# EAGLE design motoruino_2010 v1.1 (EAGLE 5.06)
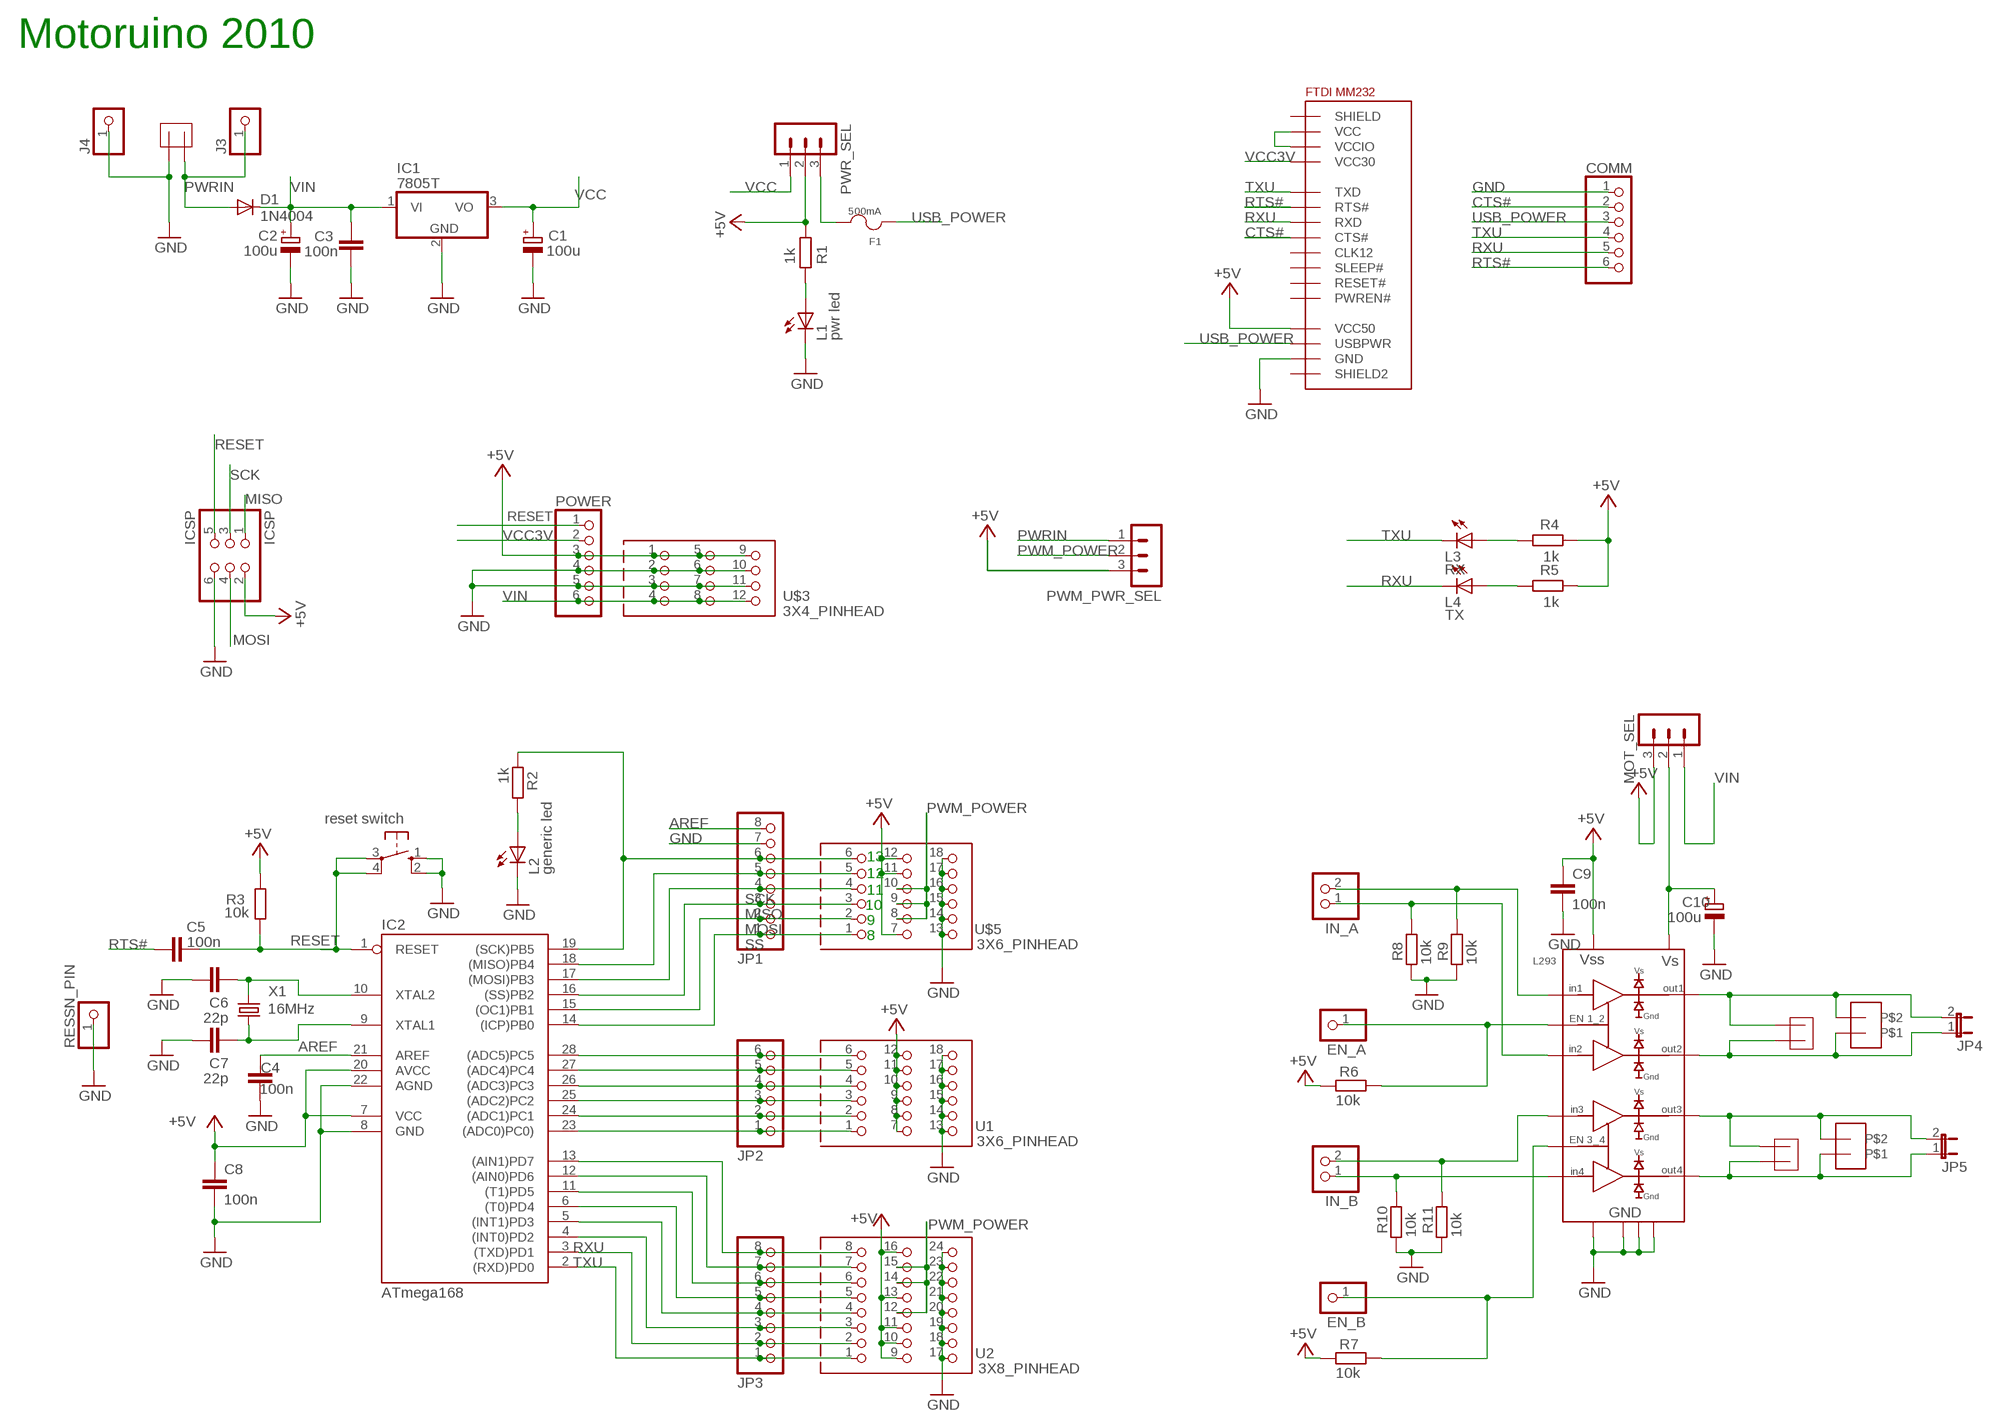
[diagram p0: schematic, sheet 1]

## Parts
C1  100u  CPOL-EUE2.5-7  [E2,5-7]
C2  100u  CPOL-EUE2.5-7  [E2,5-7]
C3  100n  C-EU025-025X050  [C025-025X050]
C4  100n  C-EU025-025X050  [C025-025X050]
C5  100n  C-EU025-025X050  [C025-025X050]
C6  22p  C-EU025-025X050  [C025-025X050]
C7  22p  C-EU025-025X050  [C025-025X050]
C8  100n  C-EU025-025X050  [C025-025X050]
C9  100n  C-EU025-025X050  [C025-025X050]
C10  100u  CPOL-EUE2.5-7  [E2,5-7]
COMM  PINHD-1X6  [1X06]
D1  1N4004  [DO41-10]
EN_A  PINHD-1X1  [1X01]
EN_B  PINHD-1X1  [1X01]
F1  500mA  FUSE  [FUSE_5MM]
IC1  7805T  [TO220H]
IC2  ATmega168  AT90S4433P  [DIL28-3]
IC3  FTDI_MM232R  [MM232_PCKG]
IC4  L293D  [DIP16]
ICSP  ICSP  PINHD-2X3  [2X03]
IN_A  PINHD-1X2  [1X02]
IN_B  PINHD-1X2  [1X02]
J3  PINHD-1X1  [1X01]
J4  PINHD-1X1  [1X01]
JP1  PINHD-1X8  [1X08]
JP2  PINHD-1X6  [1X06]
JP3  PINHD-1X8  [1X08]
JP4  JP1E  [JP1]
JP5  JP1E  [JP1]
L1  pwr led  LED3MM  [LED3MM]
L2  generic led  LED3MM  [LED3MM]
L3  RX  LED3MM  [LED3MM]
L4  TX  LED3MM  [LED3MM]
MOT_SEL  MA03-1  [MA03-1]
POWER  PINHD-1X6  [1X06]
PWM_PWR_SEL  MA03-1  [MA03-1]
PWR_SEL  MA03-1  [MA03-1]
R1  1k  R-EU_0207/10  [0207/10]
R2  1k  R-EU_0207/10  [0207/10]
R3  10k  R-EU_0207/10  [0207/10]
R4  1k  R-EU_0207/10  [0207/10]
R5  1k  R-EU_0207/10  [0207/10]
R6  10k  R-EU_0207/10  [0207/10]
R7  10k  R-EU_0207/10  [0207/10]
R8  10k  R-EU_0207/10  [0207/10]
R9  10k  R-EU_0207/10  [0207/10]
R10  10k  R-EU_0207/10  [0207/10]
R11  10k  R-EU_0207/10  [0207/10]
RESET_SW  reset switch  10-XX  [B3F-10XX]
RESSN_PIN  PINHD-1X1  [1X01]
U1  3X6_PINHEAD  [3X6_PINHEAD]
U2  3X8_PINHEAD  [3X8_PINHEAD]
U$1  2PIN_GEN  [5MM_SCREW_TERM]
U$3  3X4_PINHEAD  [3X4_PINHEAD]
U$5  3X6_PINHEAD  [3X6_PINHEAD]
U$6  2PIN_JST  [2PIN_2MMPITCH]
U$7  2PIN_GEN  [5MM_SCREW_TERM]
U$9  2PIN_JST  [2PIN_2MMPITCH]
U$10  2PIN_GEN  [5MM_SCREW_TERM]
X1  16MHz  CRYTALHC49S  [HC49/S]

## Nets
+5V [usbvcc]: C8.1 C9.1 IC2.7(VCC) IC2.20(AVCC) IC3.P$14(VCC50) IC4.P$16 ICSP.2 MOT_SEL.3 POWER.3 PWM_PWR_SEL.3 PWR_SEL.2 R1.1 R3.2 R4.2 R5.2 R6.2 R7.2 U1.7 U1.8 U1.9 U1.10 U1.11 U1.12 U2.9 U2.10 U2.11 U2.13 U2.16 U$3.1 U$3.5 U$3.9 U$5.7 U$5.11 U$5.12
AREF [aref]: C4.2 IC2.21(AREF) JP1.8
CTS#: COMM.2 IC3.P$8(CTS#)
GND [gnd]: C1.- C2.- C3.1 C4.1 C6.1 C7.1 C8.2 C9.2 C10.- COMM.1 IC1.2(GND) IC2.8(GND) IC2.22(AGND) IC3.P$13(GND) IC4.P$4 IC4.P$5 IC4.P$12 IC4.P$13 ICSP.6 J4.1 JP1.7 L1.K(C) L2.K(C) POWER.4 POWER.5 R8.2 R9.2 R10.2 R11.2 RESET_SW.1(S) RESET_SW.2(S1) RESSN_PIN.1 U1.13 U1.14 U1.15 U1.16 U1.17 U1.18 U2.17 U2.18 U2.19 U2.20 U2.21 U2.22 U2.23 U2.24 U$1.P$1 U$3.2 U$3.3 U$3.6 U$3.7 U$3.10 U$3.11 U$5.13 U$5.14 U$5.15 U$5.16 U$5.17 U$5.18
MISO: IC2.18((MISO)PB4) ICSP.1 JP1.5 U$5.5
MOSI: IC2.17((MOSI)PB3) ICSP.4 JP1.4 U$5.4
N$1: IC4.P$2 IN_A.2 R9.1
N$2: L2.A R2.1
N$3: L1.A R1.2
N$4: IC4.P$7 IN_A.1 R8.1
N$5: IC2.14((ICP)PB0) JP1.1 U$5.1
N$6: C7.2 IC2.9(XTAL1) X1.1
N$7: C6.2 IC2.10(XTAL2) X1.2
N$8: L3.A R4.1
N$9: IC4.P$15 IN_B.1 R10.1
N$10: IC2.4((INT0)PD2) JP3.3 U2.3
N$11: IC2.5((INT1)PD3) JP3.4 U2.4
N$12: IC2.6((T0)PD4) JP3.5 U2.5
N$13: IC2.11((T1)PD5) JP3.6 U2.6
N$14: IC2.12((AIN0)PD6) JP3.7 U2.7
N$15: IC2.13((AIN1)PD7) JP3.8 U2.8
N$16: IC2.23((ADC0)PC0)) JP2.1 U1.1
N$17: IC2.24((ADC1)PC1) JP2.2 U1.2
N$18: IC2.25((ADC2)PC2) JP2.3 U1.3
N$19: IC2.26((ADC3)PC3) JP2.4 U1.4
N$20: IC2.27((ADC4)PC4) JP2.5 U1.5
N$21: IC2.28((ADC5)PC5) JP2.6 U1.6
N$22: IC2.15((OC1)PB1) JP1.2 U$5.2
N$23: IC4.P$10 IN_B.2 R11.1
N$27: L4.A R5.1
N$29: IC3.P$2(VCC) IC3.P$3(VCCIO)
N$30: C10.+ IC4.P$8 MOT_SEL.2
N$31: IC4.P$6 JP4.1 U$6.P$1 U$7.P$1
N$32: EN_A.1 IC4.P$1 R6.1
N$33: IC4.P$3 JP4.2 U$6.P$2 U$7.P$2
N$34: EN_B.1 IC4.P$9 R7.1
N$35: F1.P$2 PWR_SEL.3
N$37: IC4.P$14 JP5.1 U$9.P$1 U$10.P$1
N$38: IC4.P$11 JP5.2 U$9.P$2 U$10.P$2
PWM_POWER [power]: PWM_PWR_SEL.2 U2.12 U2.14 U2.15 U$5.8 U$5.9 U$5.10
PWRIN [power]: D1.A J3.1 PWM_PWR_SEL.1 U$1.P$2
RESET: C5.2 IC2.1(RESET) ICSP.5 POWER.1 R3.1 RESET_SW.3(P) RESET_SW.4(P1)
RTS#: C5.1 COMM.6 IC3.P$6(RTS#)
RXU: COMM.5 IC2.3((TXD)PD1) IC3.P$7(RXD) JP3.2 L4.K(C) U2.2
SCK: IC2.19((SCK)PB5) ICSP.3 JP1.6 R2.2 U$5.6
SS: IC2.16((SS)PB2) JP1.3 U$5.3
TXU: COMM.4 IC2.2((RXD)PD0) IC3.P$5(TXD) JP3.1 L3.K(C) U2.1
USB_POWER: COMM.3 F1.P$1 IC3.P$15(USBPWR)
VCC [usbvcc]: C1.+ IC1.3(VO) PWR_SEL.1
VCC3V: IC3.P$4(VCC30) POWER.2
VIN [power]: C2.+ C3.2 D1.C IC1.1(VI) MOT_SEL.1 POWER.6 U$3.4 U$3.8 U$3.12
Unconnected: IC3.P$1(SHIELD) IC3.P$9(CLK12) IC3.P$10(SLEEP#) IC3.P$11(RESET#) IC3.P$12(PWREN#) IC3.P$16(SHIELD2)

## Notes on the sheet
- Motoruino 2010
- 13
- 12
- 11
- 10
- 9
- 8

## Library data of the parts
C1 C2 C10 = rcl:CPOL-EU: POLARIZED CAPACITOR, European symbol
C3-C9 = rcl:C-EU: CAPACITOR, European symbol
COMM JP2 POWER = pinhead:PINHD-1X6: PIN HEADER
D1 = diode:1N4004: DIODE general purpose rectifier, 1 A
EN_A EN_B J3 J4 RESSN_PIN = pinhead:PINHD-1X1: PIN HEADER
F1 = MeLib _Eagle:FUSE
IC1 = linear:78*: Positive VOLTAGE REGULATOR Source: http://cache.national.com/ds/LM/LM78L05.pdf http://www.fairchildsemi.com/ds/LM/LM7805.pdf
IC2 = atmel:AT90S4433: MICROCONTROLLER 4 Kbytes FLASH 128 bytes SRAM 256 bytes EEPROM UART 6-channel 10 bit ADC
IC3 = MeLib _Eagle:FTDI_MM232R
IC4 = MeLib _Eagle:L293D
ICSP = pinhead:PINHD-2X3: PIN HEADER
IN_A IN_B = pinhead:PINHD-1X2: PIN HEADER
JP1 JP3 = pinhead:PINHD-1X8: PIN HEADER
JP4 JP5 = jumper:JP1E: JUMPER
L1-L4 = led:LED: LED OSRAM: - CHIPLED LG R971, LG N971, LY N971, LG Q971, LY Q971, LO R971, LY R971 LH N974, LH R974 LS Q976, LO Q976, LY Q976 LO Q996 - Hyper CHIPLED LW Q18S LB Q993, LB Q99A, LB R99A - SideLED LS A670, LO A670, LY A670, LG A670, LP A670 LB A673, LV A673, LT A673, LW A673 LH A674 LY A675 LS A676, LA A676, LO A676, LY A676, LW A676 LS A679, LY A679, LG A679 - Hyper Micro SIDELED® LS Y876, LA Y876, LO Y876, LY Y876 LT Y87S - SmartLED LW L88C, LW L88S LB L89C, LB L89S, LG L890 LS L89K, LO L89K, LY L89K LS L896, LA L896, LO L896, LY L896 - TOPLED LS T670, LO T670, LY T670, LG T670, LP T670 LSG T670, LSP T670, LSY T670, LOP T670, LYG T670 LG T671, LOG T671, LSG T671 LB T673, LV T673, LT T673, LW T673 LH T674 LS T676, LA T676, LO T676, LY T676, LB T676, LH T676, LSB T676, LW T676 LB T67C, LV T67C, LT T67C, LS T67K, LO T67K, LY T67K, LW E67C LS E67B, LA E67B, LO E67B, LY E67B, LB E67C, LV E67C, LT E67C LW T67C LS T679, LY T679, LG T679 LS T770, LO T770, LY T770, LG T770, LP T770 LB T773, LV T773, LT T773, LW T773 LH T774 LS E675, LA E675, LY E675, LS T675 LS T776, LA T776, LO T776, LY T776, LB T776 LHGB T686 LT T68C, LB T68C - Hyper Mini TOPLED® LB M676 - Mini TOPLED Santana® LG M470 LS M47K, LO M47K, LY M47K Source: http://www.osram.convergy.de LUXEON: - LUMILED® LXK2-PW12-R00, LXK2-PW12-S00, LXK2-PW14-U00, LXK2-PW14-V00 LXK2-PM12-R00, LXK2-PM12-S00, LXK2-PM14-U00 LXK2-PE12-Q00, LXK2-PE12-R00, LXK2-PE12-S00, LXK2-PE14-T00, LXK2-PE14-U00 LXK2-PB12-K00, LXK2-PB12-L00, LXK2-PB12-M00, LXK2-PB14-N00, LXK2-PB14-P00, LXK2-PB14-Q00 LXK2-PR12-L00, LXK2-PR12-M00, LXK2-PR14-Q00, LXK2-PR14-R00 LXK2-PD12-Q00, LXK2-PD12-R00, LXK2-PD12-S00 LXK2-PH12-R00, LXK2-PH12-S00 LXK2-PL12-P00, LXK2-PL12-Q00, LXK2-PL12-R00 Source: www.luxeon.com KINGBRIGHT: KA-3528ASYC Source: www.kingbright.com
MOT_SEL PWM_PWR_SEL PWR_SEL = con-lstb:MA03-1: PIN HEADER
R1-R11 = rcl:R-EU_: RESISTOR, European symbol
RESET_SW = switch-omron:10-XX: OMRON SWITCH
U1 U$5 = MeLib _Eagle:3X6_PINHEAD
U2 = MeLib _Eagle:3X8_PINHEAD
U$1 U$7 U$10 = MeLib _Eagle:2PIN_GEN
U$3 = MeLib _Eagle:3X4_PINHEAD
U$6 U$9 = MeLib _Eagle:2PIN_JST
X1 = crystal:CRYTAL: CRYSTAL

## Net classes
0 default: width 0.254 mm, drill 0.305 mm, clearance 0.152 mm
1 power: clearance 0.152 mm
2 gnd: clearance 0.152 mm
3 usbvcc: clearance 0.152 mm

## Board
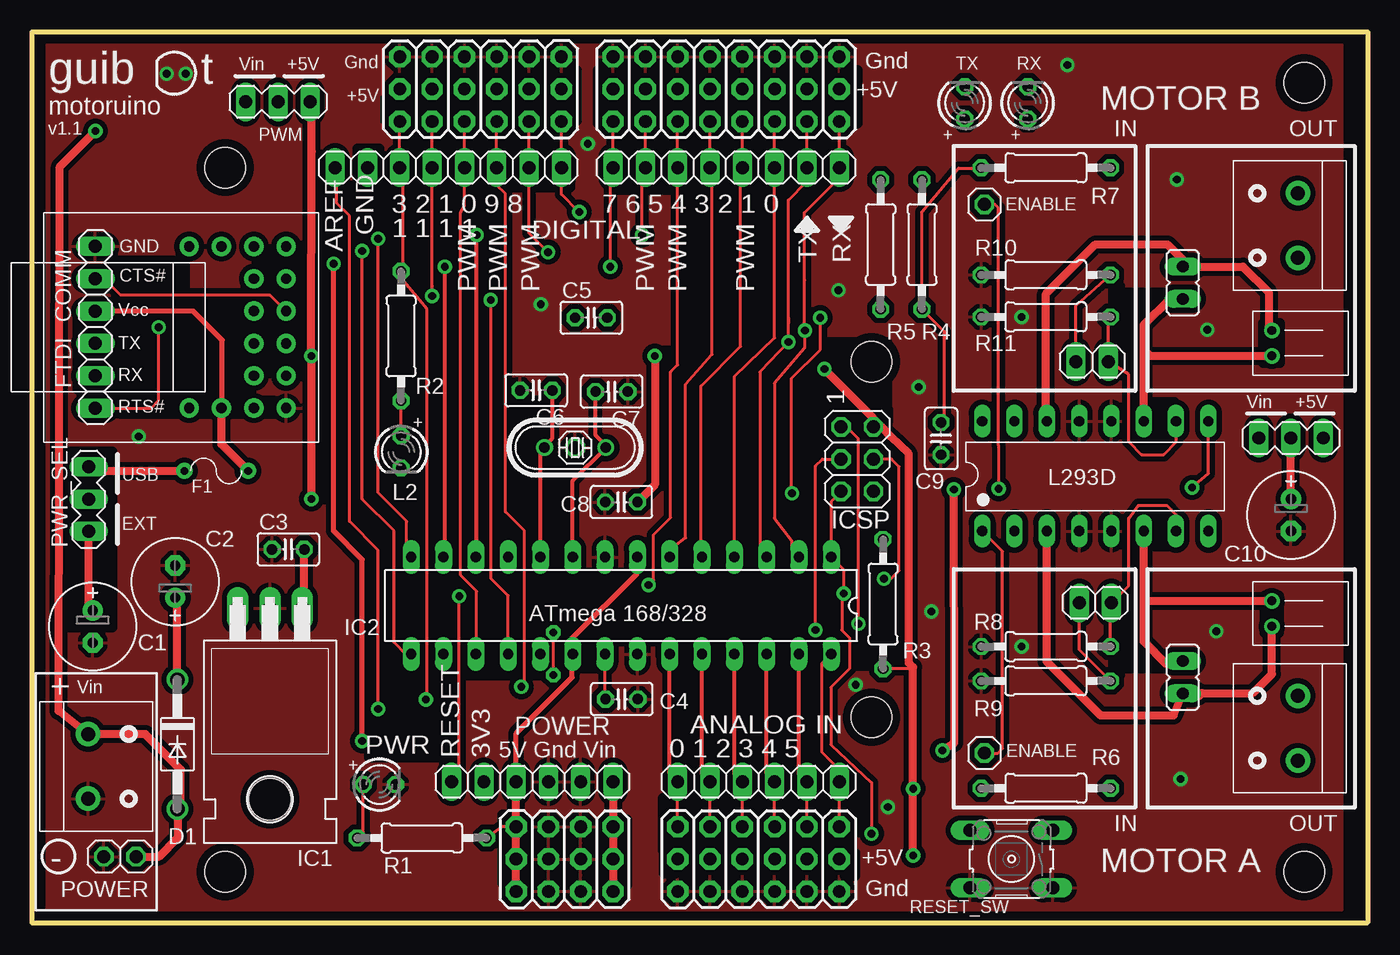
[diagram p1: board, top side]
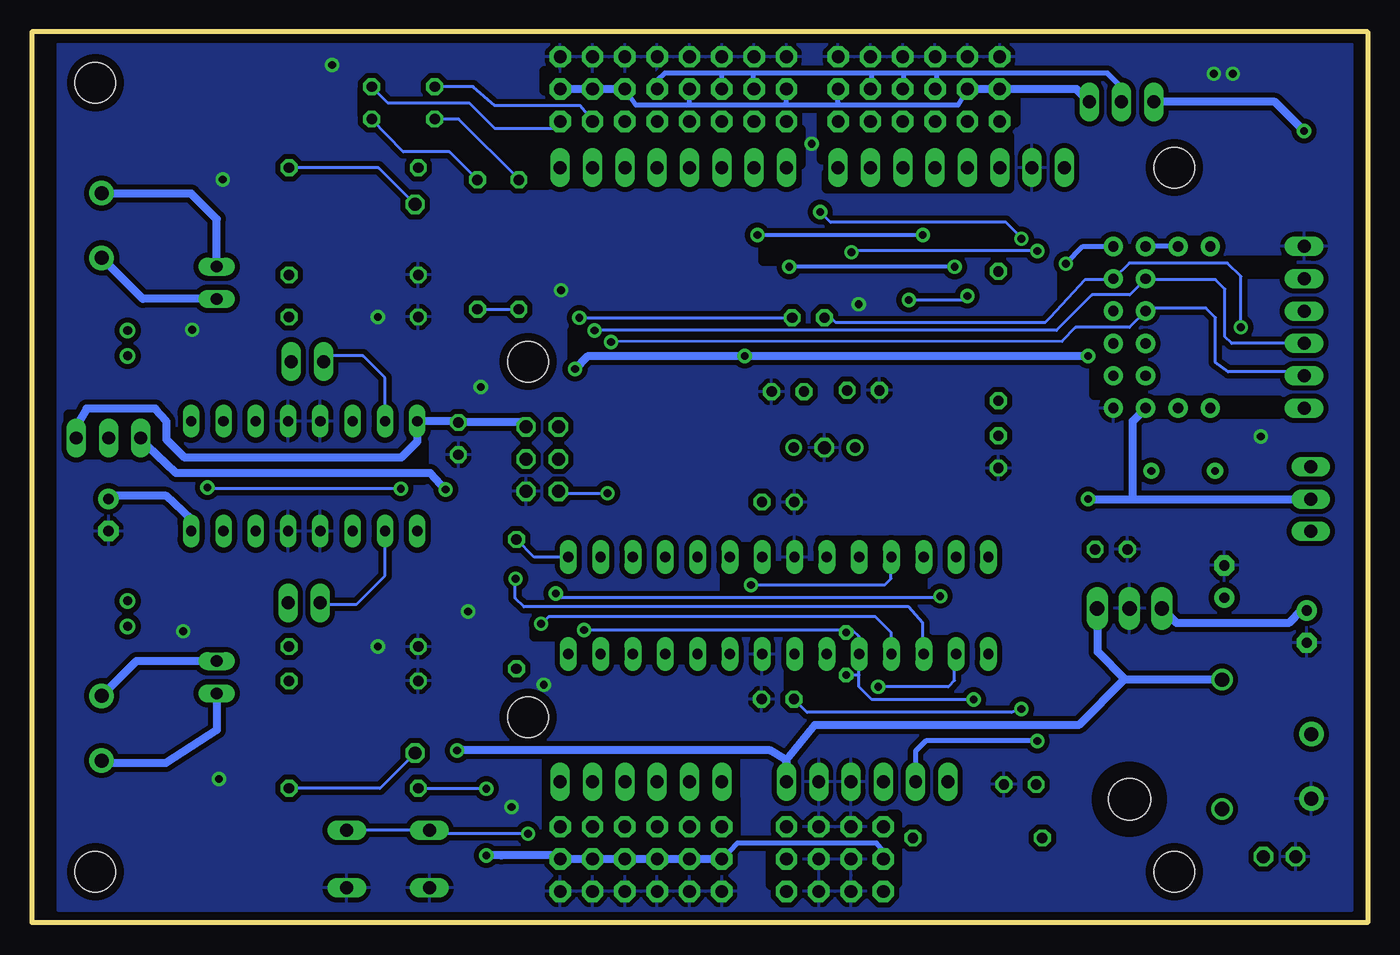
[diagram p2: board, bottom side, seen from below]

Size 105 x 70 mm. Coordinates in mm from the lower left corner, seen from the top.
Outline: 0,70 105,70 105,0 0,0 0,70
Copper layers (1*16): Top 0.0356mm / dielectric 1.5011mm / Bottom 0.0356mm
Design rules "rules_micron20 *": minimum track width 8mil, minimum drill 24mil, track to track 10mil, track to pad 8mil, pad to pad 8mil, via to via 8mil, smd to smd 8mil, copper to edge 25mil, drill to drill 6mil, minimum pad ring 10mil, minimum via ring 10mil, stop-mask expansion 4mil, vias tented up to drill 0mil, thermal gap 15mil
Holes 3.2 mm at 66.01,44.1 66.01,16.16 15.21,59.34 15.21,4 100,4 100,66
tRestrict: area 26.3,19.5 to 40.1,22.5; area 27.5,32.7 to 31.3,33.4; area 51.4,60.6 to 63.4,62.7; area 49.3,43 to 50.8,44.9; area 29.2,62 to 36.7,62.7; area 22.1,33.3 to 23.4,34.2; area 60.3,39.4 to 67.3,40.3; area 61.7,22.1 to 65.2,24.1; area 27.8,63 to 28.8,64.8; area 42.2,63 to 42.8,67; area 37,57.8 to 42.3,60.4; area 44.5,62.8 to 45,67; 38 more areas
bRestrict: area 74.2,34.8 to 74.7,37.7; area 49.7,9.6 to 64.5,13.2; area 20.8,44.9 to 21.7,46.4; area 12.8,53.1 to 14.5,53.6; area 50.5,20.7 to 63.1,22.4; area 32.7,20.1 to 44.7,22.2; area 95.5,36.8 to 102.1,39.9; area 49.7,5.9 to 50.6,9.7; area 64.1,5.8 to 64.5,9.8; area 44.9,58.1 to 64.3,59.1; area 44.6,59.6 to 44.9,62.3; area 63.9,59.8 to 64.3,62.1; 21 more areas

### Footprints (pad centres in the part's own frame; a part is rotated, then mirrored left to right if it is on the bottom)
E2,5-7 = drill 0.813 pad 1.6 round: + -1.27,0 | drill 0.813 pad 1.6 octagon: - 1.27,0
C025-025X050 = drill 0.813 octagon: 1 -1.27,0; 2 1.27,0
1X06 = drill 1.016 long: 1 -6.35,0; 2 -3.81,0; 3 -1.27,0; 4 1.27,0; 5 3.81,0; 6 6.35,0
DO41-10 = drill 1.118 round: A 5.08,0; C -5.08,0
1X01 = drill 1.016 octagon: 1 0,0
FUSE_5MM = drill 0.61 pad 1.27 round: P$1 -2.5,0; P$2 2.5,0
TO220H = drill 1.118 long: 1 -2.54,-10.16; 2 0,-10.16; 3 2.54,-10.16 | hole 3.302: 0,4.826
DIL28-3 = drill 0.813 long: 1 -16.51,-3.81; 2 -13.97,-3.81; 3 -11.43,-3.81; 4 -8.89,-3.81; 5 -6.35,-3.81; 6 -3.81,-3.81; 7 -1.27,-3.81; 8 1.27,-3.81; 9 3.81,-3.81; 10 6.35,-3.81; 11 8.89,-3.81; 12 11.43,-3.81; 13 13.97,-3.81; 14 16.51,-3.81; 15 16.51,3.81; 16 13.97,3.81; 17 11.43,3.81; 18 8.89,3.81; 19 6.35,3.81; 20 3.81,3.81; 21 1.27,3.81; 22 -1.27,3.81; 23 -3.81,3.81; 24 -6.35,3.81; 25 -8.89,3.81; 26 -11.43,3.81; 27 -13.97,3.81; 28 -16.51,3.81
MM232_PCKG = drill 0.813 pad 1.524 round: P$1 -6.35,6.35; P$2 -3.81,6.35; P$3 -1.27,6.35; P$4 1.27,6.35; P$5 -1.27,3.81; P$6 1.27,3.81; P$7 -1.27,1.27; P$8 1.27,1.27; P$9 1.27,-1.27; P$10 -1.27,-1.27; P$11 1.27,-3.81; P$12 -1.27,-3.81; P$13 1.27,-6.35; P$14 -1.27,-6.35; P$15 -3.81,-6.35; P$16 -6.35,-6.35
DIP16 = drill 0.8 long: P$1 -4.445,7.62; P$2 -4.445,5.08; P$3 -4.445,2.54; P$4 -4.445,0; P$5 -4.445,-2.54; P$6 -4.445,-5.08; P$7 -4.445,-7.62; P$8 -4.445,-10.16; P$9 4.191,-10.16; P$10 4.191,-7.62; P$11 4.191,-5.08; P$12 4.191,-2.54; P$13 4.191,0; P$14 4.191,2.54; P$15 4.191,5.08; P$16 4.191,7.62
2X03 = drill 1.016 octagon: 1 -2.54,-1.27; 2 -2.54,1.27; 3 0,-1.27; 4 0,1.27; 5 2.54,-1.27; 6 2.54,1.27
1X02 = drill 1.016 long: 1 -1.27,0; 2 1.27,0
1X08 = drill 1.016 long: 1 -8.89,0; 2 -6.35,0; 3 -3.81,0; 4 -1.27,0; 5 1.27,0; 6 3.81,0; 7 6.35,0; 8 8.89,0
JP1 = drill 0.914 long: 1 0,-1.27; 2 0,1.27
LED3MM = drill 0.813 octagon: A -1.27,0; K 1.27,0
MA03-1 = drill 1.016 long: 1 -2.54,0; 2 0,0; 3 2.54,0
0207/10 = drill 0.813 octagon: 1 -5.08,0; 2 5.08,0
B3F-10XX = drill 1.016 long: 1 -3.251,2.261; 2 3.251,2.261; 3 -3.251,-2.261; 4 3.251,-2.261
3X6_PINHEAD = drill 1 pad 1.676 octagon: 1 -6.35,2.54; 2 -3.81,2.54; 3 -1.27,2.54; 4 1.27,2.54; 5 3.81,2.54; 6 6.35,2.54; 7 -6.35,0; 8 -3.81,0; 9 -1.27,0; 10 1.27,0; 11 3.81,0; 12 6.35,0; 13 -6.35,-2.54; 14 -3.81,-2.54; 15 -1.27,-2.54; 16 1.27,-2.54; 17 3.81,-2.54; 18 6.35,-2.54
3X8_PINHEAD = drill 1 pad 1.676 octagon: 1 -8.89,2.54; 2 -6.35,2.54; 3 -3.81,2.54; 4 -1.27,2.54; 5 1.27,2.54; 6 3.81,2.54; 7 6.35,2.54; 8 8.89,2.54; 9 -8.89,0; 10 -6.35,0; 11 -3.81,0; 12 -1.27,0; 13 1.27,0; 14 3.81,0; 15 6.35,0; 16 8.89,0; 17 -8.89,-2.54; 18 -6.35,-2.54; 19 -3.81,-2.54; 20 -1.27,-2.54; 21 1.27,-2.54; 22 3.81,-2.54; 23 6.35,-2.54; 24 8.89,-2.54
5MM_SCREW_TERM = drill 1.1 pad 1.93 round: P$1 2.54,2.54; P$2 2.54,-2.54
3X4_PINHEAD = drill 1 pad 1.676 octagon: 1 -3.81,2.54; 2 -1.27,2.54; 3 1.27,2.54; 4 3.81,2.54; 5 -3.81,0; 6 -1.27,0; 7 1.27,0; 8 3.81,0; 9 -3.81,-2.54; 10 -1.27,-2.54; 11 1.27,-2.54; 12 3.81,-2.54
2PIN_2MMPITCH = drill 0.7 round: P$1 0,1; P$2 0,-1
HC49/S = drill 0.813 round: 1 -2.413,0; 2 2.413,0

### Placement (x,y rotation side)
C1  4.79,23.27 270 top
C2  11.27,26.8 90 top
C3  20.15,29.33 0 top
C4  46.37,17.57 180 top
C5  43.97,47.54 0 top
C6  39.64,41.83 0 top
C7  45.58,41.73 180 top
C8  46.34,33.06 180 top
C9  71.47,38.04 270 top
C10  98.97,32.04 270 top
COMM  5,46.79 270 top
D1  11.44,14.02 270 top
EN_A  74.87,13.34 0 top
EN_B  74.87,56.44 0 top
F1  14.5,35.5 180 top
IC1  18.72,14.54 180 top
IC2  46.32,24.92 180 top
IC3  18.72,46.79 0 top
IC4  82.32,35.22 90 top
ICSP  64.88,36.43 270 top
IN_A  83.59,25.14 180 top
IN_B  83.34,44.09 0 top
J3  8.2,5.2 0 top
J4  5.66,5.2 0 top
JP1  32.74,59.34 180 top
JP2  57.12,11.08 0 top
JP3  54.58,59.34 180 top
JP4  90.47,19.29 180 top
JP5  90.47,50.29 180 top
L1  27.32,10.86 0 top
L2  29.03,37 270 top
L3  78.28,64.41 90 top
L4  73.33,64.41 90 top
MOT_SEL  98.97,38.09 0 top
POWER  39.34,11.08 0 top
PWM_PWR_SEL  19.35,64.5 0 top
PWR_SEL  4.47,33.29 90 top
R1  30.66,6.66 180 top
R2  29.02,46.1 90 top
R3  66.91,25.04 270 top
R4  69.97,53.29 270 top
R5  66.72,53.29 270 top
R6  79.7,10.56 180 top
R7  79.7,59.31 180 top
R8  79.7,21.7 180 top
R9  79.7,19 180 top
R10  79.7,50.9 180 top
R11  79.7,47.6 180 top
RESET_SW  77,5 180 top
RESSN_PIN  42.7,37.33 0 top
U1  57.12,5 0 top
U2  54.58,65.5 180 top
U$1  6.97,12.29 180 top
U$3  41.88,5 0 top
U$5  35.28,65.5 180 top
U$6  97.47,24.29 0 top
U$7  96.97,15.29 0 top
U$9  97.47,45.54 0 top
U$10  96.97,54.79 0 top
X1  42.7,37.33 180 top

### Tracks (layer width: path | path; a pad name or v marks a point on that pad's centre or on a via)
+5V  (via drill 0.61)
  Top 0.203: IC2.20 42.52,21.13 42.47,21.06
  Top 0.254: 66.79,38.97 ICSP.2 | POWER.3 38.22,10.93 | R3.2 69.3,19.96 69.27,20.09 | C9.1 71.74,39.3 71.74,46.44 R4.2 69.97,55.87 72.85,59.3 74.79,59.3 R7.2 | R1.1 36.91,7.53 U$3.1
  Top 0.406: C8.1 47.59,33.04 | POWER.3 38.07,14.88 42.47,19.29 42.47,21.06 | IC2.7 47.59,27.46 42.47,22.34 42.47,21.15 IC2.20
  Top 0.61: C8.1 48.97,34.41 v48.97,44.53 | v21.97,33.28 v21.97,44.53 22,60.6 22,64.39 PWM_PWR_SEL.3 | 66.79,38.97 67.54,38.16 68.94,36.85 68.94,20.42 69.27,20.09 v69.27,10.54 v69.27,5.29 | v62.3,43.5 66.15,39.65 ICSP.2 | U$3.9 U$3.5 U$3.1 POWER.3
  Bottom 0.254: R4.2 R5.2 | R6.2 74.59,10.54 v69.27,10.54
  Bottom 0.406: C9.1 71.57,39.41 | 66.49,39.3 ICSP.2 66.15,39.35 | U$5.11 32.2,64.25 41.35,64.25 | 41.35,64.25 45.9,64.25 | 45.9,64.25 53.6,64.25 | 53.6,64.25 57.51,64.25 U2.11 | U2.13 53.31,64.29 53.6,64.25 | U2.16 45.69,64.41 45.9,64.25 | U$5.7 41.63,64.37 41.35,64.25 | U1.7 49.56,6.25 38.6,6.25 38.07,5.67 U$3.5
  Bottom 0.61: 71.57,39.41 IC4.P$16 74.7,37.81 75.97,36.53 92.97,36.53 94.4,37.97 94.4,39.4 95.3,40.4 100.7,40.4 101.51,38.99 MOT_SEL.3 | 66.49,39.3 C9.1 | 18.47,33.28 PWR_SEL.2 | IC3.P$14 18.47,39.41 18.47,33.28 | v48.97,44.53 v21.97,44.53 | v48.97,44.53 48.47,44.53 | v21.97,33.28 18.47,33.28 | U1.7 U1.8 U1.9 U1.10 U1.11 | U1.11 U1.12 | U1.11 U1.12 | U$5.11 U$5.12 22.89,65.5 PWM_PWR_SEL.3 | U2.9 U2.10 U2.11 | U1.12 63.59,5.29 68.1,5.3 69.25,5.3 v69.27,5.29 | v48.97,44.53 61.27,44.53 v62.3,43.5
AREF  (via drill 0.61)
  Top 0.254: v27.22,16.79 27.22,29.29 24.97,31.54 24.97,55.53 23.97,56.53 23.97,59.21 JP1.8 | IC2.21 45.05,17.61 C4.2
  Bottom 0.254: v27.22,16.79 27.97,16.54 44.06,16.54 C4.2
CTS#
  Top 0.254: IC3.P$8 18.71,49.34 6.96,49.34 5.8,50.5 5.09,50.5 COMM.2
GND  (via drill 0.61)
  Top 0.254: C4.1 47.59,17.61
  Top 0.406: C8.2 45.05,33.04
  other vias: 90.3,11.3 90,58.4 81.4,67.4 93.1,22.9 40,48.6 8.4,38.2 10.6,66.7 12.1,66.7 64.75,18.7 70.7,24.45 63.4,49.7 77.8,47.6 77.8,21.7 92.4,46.6 67.3,9.1 69.7,42.1 43.7,61.2
  pour Bottom (isolate 0.406): 1.2,69 102.97,69 102.97,1 1.2,1
  pour Top (isolate 0.406): 1.2,69 102.97,69 102.97,1 1.2,1
  pour Top: 40.6,11.2 40.6,1.3 43.2,1.3 43.2,11.2
MISO  (via drill 0.61)
  Top 0.254: IC2.18 37.43,25.7 36.09,27.04 36.09,48.91 v36.07,48.94 | v64.97,23.48 64.97,38.03 64.04,38.97 ICSP.1 | v31.47,49.23 31.46,50.04 JP1.5 U$5.5
  Bottom 0.254: v64.97,23.48 64.37,24.04 38.68,24.04 37.43,22.79 IC2.18 | v31.47,49.23 31.77,48.94 v36.07,48.94
MOSI  (via drill 0.61)
  Top 0.254: IC2.17 34.97,21.18 34.97,26.04 33.72,27.29 33.72,55.78 34.01,56.32 JP1.4 U$5.4 | v66.97,27.04 67,27 67.5,27 68.17,27.67 68.17,35.84 67.58,36.42 ICSP.4
  Bottom 0.254: IC2.17 34.97,21.18 34.97,23.54 36.09,24.81 66.31,24.81 67,25.5 67,27 v66.97,27.04
N$1
  Top 0.254: R9.1 82.33,21.46 IN_A.2
  Bottom 0.254: IC4.P$2 77.24,27.27 79.47,25.04 82.22,25.04 IN_A.2
N$2
  Top 0.254: L2.A R2.1
N$3
  Top 0.254: R1.2 26.05,7.13 L1.A
N$4
  Top 0.254: IC4.P$7 89.97,30.8 89.97,32.03 89.22,32.78 86.97,32.78 86.22,31.79 86.22,26.49 IN_A.1 84.78,25.05 R8.1
N$5  (via drill 0.61)
  Top 0.254: IC2.14 29.47,29.07 29.47,31.54 27.22,33.78 v27.22,53.73 | U$5.1 JP1.1 41.63,57.23 v43.03,55.84
  Bottom 0.254: v43.03,55.84 42.23,55.03 28.43,55.03 27.22,53.82 v27.22,53.73
N$6
  Top 0.305: IC2.9 42.51,34.73 X1.1 45.27,37.33 44.31,38.29 C7.2
N$7
  Top 0.305: IC2.10 39.97,37.02 X1.2 40.17,37.33 40.91,38.07 C6.2
N$8
  Bottom 0.254: R4.1 72.18,60.58 75.81,60.58 L3.A
N$9
  Top 0.254: IN_B.1 82.08,48.49 R10.1
  Bottom 0.254: IC4.P$15 77.24,42.8 78.97,44.53 81.92,44.53 IN_B.1
N$10
  Top 0.254: IC2.4 55.22,29.41 55.22,30.06 55.22,42.94 58.39,45.95 JP3.3 U2.3
N$11
  Top 0.254: IC2.5 52.59,28.81 52.59,42.16 55.72,45.28 55.72,59.2 JP3.4 U2.4
N$12
  Top 0.254: IC2.6 50.47,29.06 50.47,29.54 51.38,30.25 51.38,42.33 53.47,44.66 53.47,59.17 JP3.5 U2.5
N$13  (via drill 0.61)
  Top 0.254: v48.47,26.54 48.87,26.93 48.87,30.48 50.22,31.84 50.22,43.28 50.77,43.84 JP3.6 U2.6
  Bottom 0.254: v48.47,26.54 37.97,26.54 37.47,27.04 37.47,28.69 IC2.11
N$14  (via drill 0.61)
  Top 0.254: v47.97,54.03 47.97,59.08 JP3.7 U2.7
  Top 0.305: v34.97,54.03 34.97,28.8 IC2.12
  Bottom 0.305: v34.97,54.03 v47.97,54.03
N$15  (via drill 0.61)
  Top 0.254: v45.47,51.53 45.47,59.12 JP3.8 U2.8
  Top 0.305: v32.47,51.53 32.47,28.84 IC2.13
  Bottom 0.305: v32.47,51.53 v45.47,51.53
N$16
  Top 0.254: 50.13,11.71 JP2.1 U1.1
  Top 0.305: 50.13,11.71 IC2.23
N$17
  Top 0.254: 52.67,11.71 JP2.2 U1.2
  Top 0.305: 52.67,11.71 IC2.24
N$18
  Top 0.254: 55.22,11.71 JP2.3 U1.3
  Top 0.305: 55.22,11.71 IC2.25
N$19
  Top 0.254: 57.76,11.71 JP2.4 U1.4
  Top 0.305: 57.76,11.71 IC2.26
N$20
  Top 0.254: 60.29,11.71 JP2.5 U1.5
  Top 0.305: 60.29,11.71 IC2.27
N$21
  Top 0.254: U1.6 JP2.6 63.5,11.11 63.5,12 62.1,13.4 62.1,20.37 IC2.28
N$22  (via drill 0.61)
  Top 0.254: IC2.15 29.74,21.04 29.47,21.04 28.47,22.04 28.47,30.79 25.97,33.28 v25.97,52.78 | v40.59,52.69 39.09,54.19 JP1.2 U$5.2
  Bottom 0.254: v25.97,52.78 40.49,52.78 v40.59,52.69
N$23
  Top 0.254: IC4.P$10 89.97,39.38 89.97,37.78 88.97,36.78 87.22,36.78 86.22,37.78 86.22,43.08 IN_B.2 84.61,47.73 R11.1
N$27
  Bottom 0.254: L4.A 71.44,63.15 66.72,58.42 R5.1
N$29
  Bottom 0.406: IC3.P$2 IC3.P$3
N$30
  Top 0.61: C10.+ MOT_SEL.2
  Bottom 0.61: IC4.P$8 92.48,31.7 94.42,33.53 98.74,33.53 C10.+
N$31
  Top 0.61: 87.4,25.29 87.4,22.11 89.22,20.29 91.2,20.29 JP4.1 | 87.4,25.29 IC4.P$6 | 87.4,25.29 U$6.P$1
  Bottom 0.61: JP4.1 96.78,20.55 U$7.P$1
N$32
  Top 0.254: IC4.P$1 76.3,29.17 76.3,13.7 75.94,13.34 EN_A.1 75.62,13.23
  Bottom 0.254: R6.1 77.64,10.56 EN_A.1
N$33
  Top 0.61: U$6.P$2 97.47,19.54 95.97,18.04 91.97,18.04 | 91.97,18.04 91.49,18.04 JP4.2 | 91.97,18.04 91.72,17.79 | JP4.2 91.45,18.04 | IC4.P$3 79.78,20.52 84,16.3 89.75,16.3 JP4.2
  Bottom 0.61: JP4.2 90.47,15.13 94.47,12.54 99.3,12.54 U$7.P$2
N$34  (via drill 0.61)
  Top 0.254: EN_B.1 75.7,56.44 75.97,56.17 75.97,37.53 76,37.51 v76,34.1 | IC4.P$9 92.48,35.28 v91.2,34.2
  Bottom 0.254: v76,34.1 91.1,34.1 v91.2,34.2 | R7.1 77.75,59.31 EN_B.1
N$35
  Top 0.61: 4.76,35.53 PWR_SEL.3 4.79,35.5 F1.P$2
N$37
  Top 0.61: 91,51.55 JP5.1 90.45,51.53 | 91,51.55 95.2,51.55 97.22,49.53 97.22,46.78 U$9.P$1 | IC4.P$14 79.72,39.47 79.72,49.42 83.6,53.3 89.25,53.3 91,51.55
  Bottom 0.61: JP5.1 90.47,55.28 92.47,57.28 99.47,57.28 U$10.P$1
N$38
  Top 0.61: IC4.P$11 87.4,45.03 | 87.4,45.03 87.4,46.97 89.47,49.03 90.45,49.03 JP5.2 | U$9.P$2 87.9,44.53 87.4,45.03
  Bottom 0.61: JP5.2 96.28,49.02 U$10.P$2
PWM_POWER
  Bottom 0.406: 33.9,66.75 36.5,66.75 | 36.5,66.75 39,66.75 | 39,66.75 48.3,66.75 | 48.3,66.75 50.8,66.75 | 50.8,66.75 55.25,66.75 55.82,66.18 U2.12 | U$5.10 33.9,65.78 33.9,66.75 | U$5.9 36.5,65.72 36.5,66.75 | U$5.8 39,65.67 39,66.75 | U2.15 48.3,65.61 48.3,66.75 | U2.14 50.8,65.55 50.8,66.75 | 33.9,66.75 20.45,66.75 19.4,65.7 19.4,64.55 PWM_PWR_SEL.2
PWRIN  (via drill 0.61)
  Top 0.61: v5,62.2 2.2,59.4 2.1,16.66 U$1.P$2 8.93,14.82 11.72,12.04 11.72,9.22 D1.A 11.5,8.88 11.5,6.7 10,5.2 J3.1
  Bottom 0.61: v5,62.2 7.3,64.5 PWM_PWR_SEL.1
RESET  (via drill 0.61)
  Top 0.254: v61.97,47.53 61.97,45.03 59.72,42.78 59.72,33.78 v59.75,33.75 | v66,7 66,11 62.8,14 62.8,18.5 64.25,19.95 64.25,22.4 63.67,22.98 63.67,25.72 v63.81,25.87 63.81,27.75 IC2.1 62.83,33.11 ICSP.5 | v33.59,25.66 33.59,11.68 POWER.1
  Bottom 0.254: v33.59,25.66 33.72,25.54 63.52,25.54 v63.81,25.87 | R3.1 65.52,28.73 IC2.1 | v61.97,47.53 C5.2 | v59.75,33.75 63.47,33.75 ICSP.5 | v66,7 73.49,7 RESET_SW.4 RESET_SW.3
RTS#  (via drill 0.61)
  Top 0.254: v9.97,46.78 9.97,41.03 9.37,40.44 COMM.6
  Bottom 0.254: v9.97,46.78 9.97,50.78 11.02,51.84 18.75,51.84 IC3.P$6 20.05,50.53 22.22,50.53 24.97,47.53 25.36,47.15 41.8,47.15 42.19,47.53 C5.1
RXU  (via drill 0.61)
  Top 0.254: IC2.3 57.22,29.51 57.22,43.28 v59.47,45.63 59.47,47.53 | 59.47,47.53 59.47,56.78 60.93,58.24 JP3.2 U2.2 | 59.47,47.53 59.47,47.12
  Bottom 0.254: v59.47,45.63 24.02,45.69 22.97,46.78 18.72,46.78 IC3.P$7 17.22,48.28 12.72,48.28 11.97,47.53 11.97,44.03 10.97,43.28 5.31,43.28 COMM.5 | U2.2 60.93,63.03 61.9,64.2 68.6,64.2 70.3,65.7 73.31,65.7 L4.K
SCK  (via drill 0.61)
  Top 0.254: v30.97,17.54 31.07,17.64 31.07,48.19 29.04,50.64 29.02,50.66 R2.2 29.2,51.35 29.2,58.2 28.93,58.47 JP1.6 U$5.6 | ICSP.3 62.12,36.42 61.6,35.9 v61.6,23 | v41,19.46 v41,22.81
  Bottom 0.254: v30.97,17.54 38.97,17.54 39.97,18.54 39.97,19.46 | 39.97,19.46 IC2.19 | 41,23 40.5,23 40,22.5 40,21.13 IC2.19 | 41,23 v61.6,23 | v41,22.81 41,23 | 39.97,19.46 v41,19.46
SS  (via drill 0.61)
  Top 0.254: v38.47,18.54 38.72,18.91 38.72,30.79 37.22,32.28 37.22,57.28 36.55,57.96 JP1.3 U$5.3
  Bottom 0.254: v38.47,18.54 32.97,18.54 32.47,19.04 32.47,20.99 IC2.16
TXU  (via drill 0.61)
  Top 0.254: IC2.2 59.72,29.3 59.72,30.04 58.37,31.79 58.37,42.38 60.72,45.13 60.72,46.28 | 60.72,50.53 60.72,50.45 | 60.72,50.53 60.72,55.78 63.47,58.53 JP3.1 U2.1 | 60.72,46.28 60.72,50.53 | v60.77,46.53 60.72,46.53 60.72,46.28
  Bottom 0.254: v60.77,46.53 24.47,46.53 21.67,49.34 18.71,49.34 IC3.P$5 17.39,50.53 11.97,50.53 11.22,49.78 11.22,46.03 10.7,45.52 COMM.4 | U2.1 63.61,62.4 68.6,62.4 70.6,64.4 77,64.4 L3.K
USB_POWER
  Top 0.406: 14.91,40.84 IC3.P$15 14.97,40.49 14.97,45.78 12.7,48.05 COMM.3
  Top 0.61: IC3.P$15 14.91,37.59 F1.P$1
VCC
  Top 0.61: C1.+ 4.47,24.86 PWR_SEL.1
  Bottom 0.61: IC1.3 15.02,23.54 6.22,23.54 5.21,24.54 C1.+
VCC3V  (via drill 0.61)
  Top 0.406: v25.97,14.29 25.97,28.54 23.72,30.79 v23.72,51.78
  Bottom 0.406: POWER.2 35.53,13.47 34.72,14.29 v25.97,14.29 | v23.72,51.78 22.37,53.13 IC3.P$4
VIN  (via drill 0.61)
  Top 0.61: v71.57,13.54 72.5,14.13 72.5,15.6 v72.47,34.03 | D1.C 11.44,25.36 C2.+ | IC1.1 21.42,24.86 C3.2 | POWER.6 U$3.4 U$3.8 U$3.12
  Bottom 0.61: 19.16,19.1 22.72,15.54 43.47,15.54 45.69,12.81 POWER.6 45.69,12.76 46.97,13.54 v71.57,13.54 | D1.C 19.16,19.1 | 19.16,19.1 19.03,19.1 21.22,21.29 21.22,24.66 IC1.1 | v72.47,34.03 73.67,35.34 93.67,35.34 95.92,37.48 MOT_SEL.1

### Text on the board
tPlace: TX | RX | guib | t | motoruino | v1.1 | + | + | COMM | FTDI | + | + | Gnd
tNames: Vin | +5V | Gnd | Gnd | +5V | +5V | MOTOR B | IN | OUT | PWM | 3 2 1 0 9 8 | 7 6 5 4 3 2 1 0 | ENABLE | GND | 1 1 1 1 | DIGITAL | GND | AREF | TX | RX | CTS# | PWM | PWM | PWM | PWM | PWM | PWM | Vcc | TX | RX | 1 | RTS# | Vin | +5V | USB | L293D | EXT | ATmega 168/328 | + | Vin | PWR | ANALOG IN | RESET | 3V3 | 5V Gnd Vin | 0 1 2 3 4 5 | ENABLE | IN | OUT | - | +5V | MOTOR A | POWER | Gnd